# EAGLE design VOLTHAT (EAGLE 9.6.0)
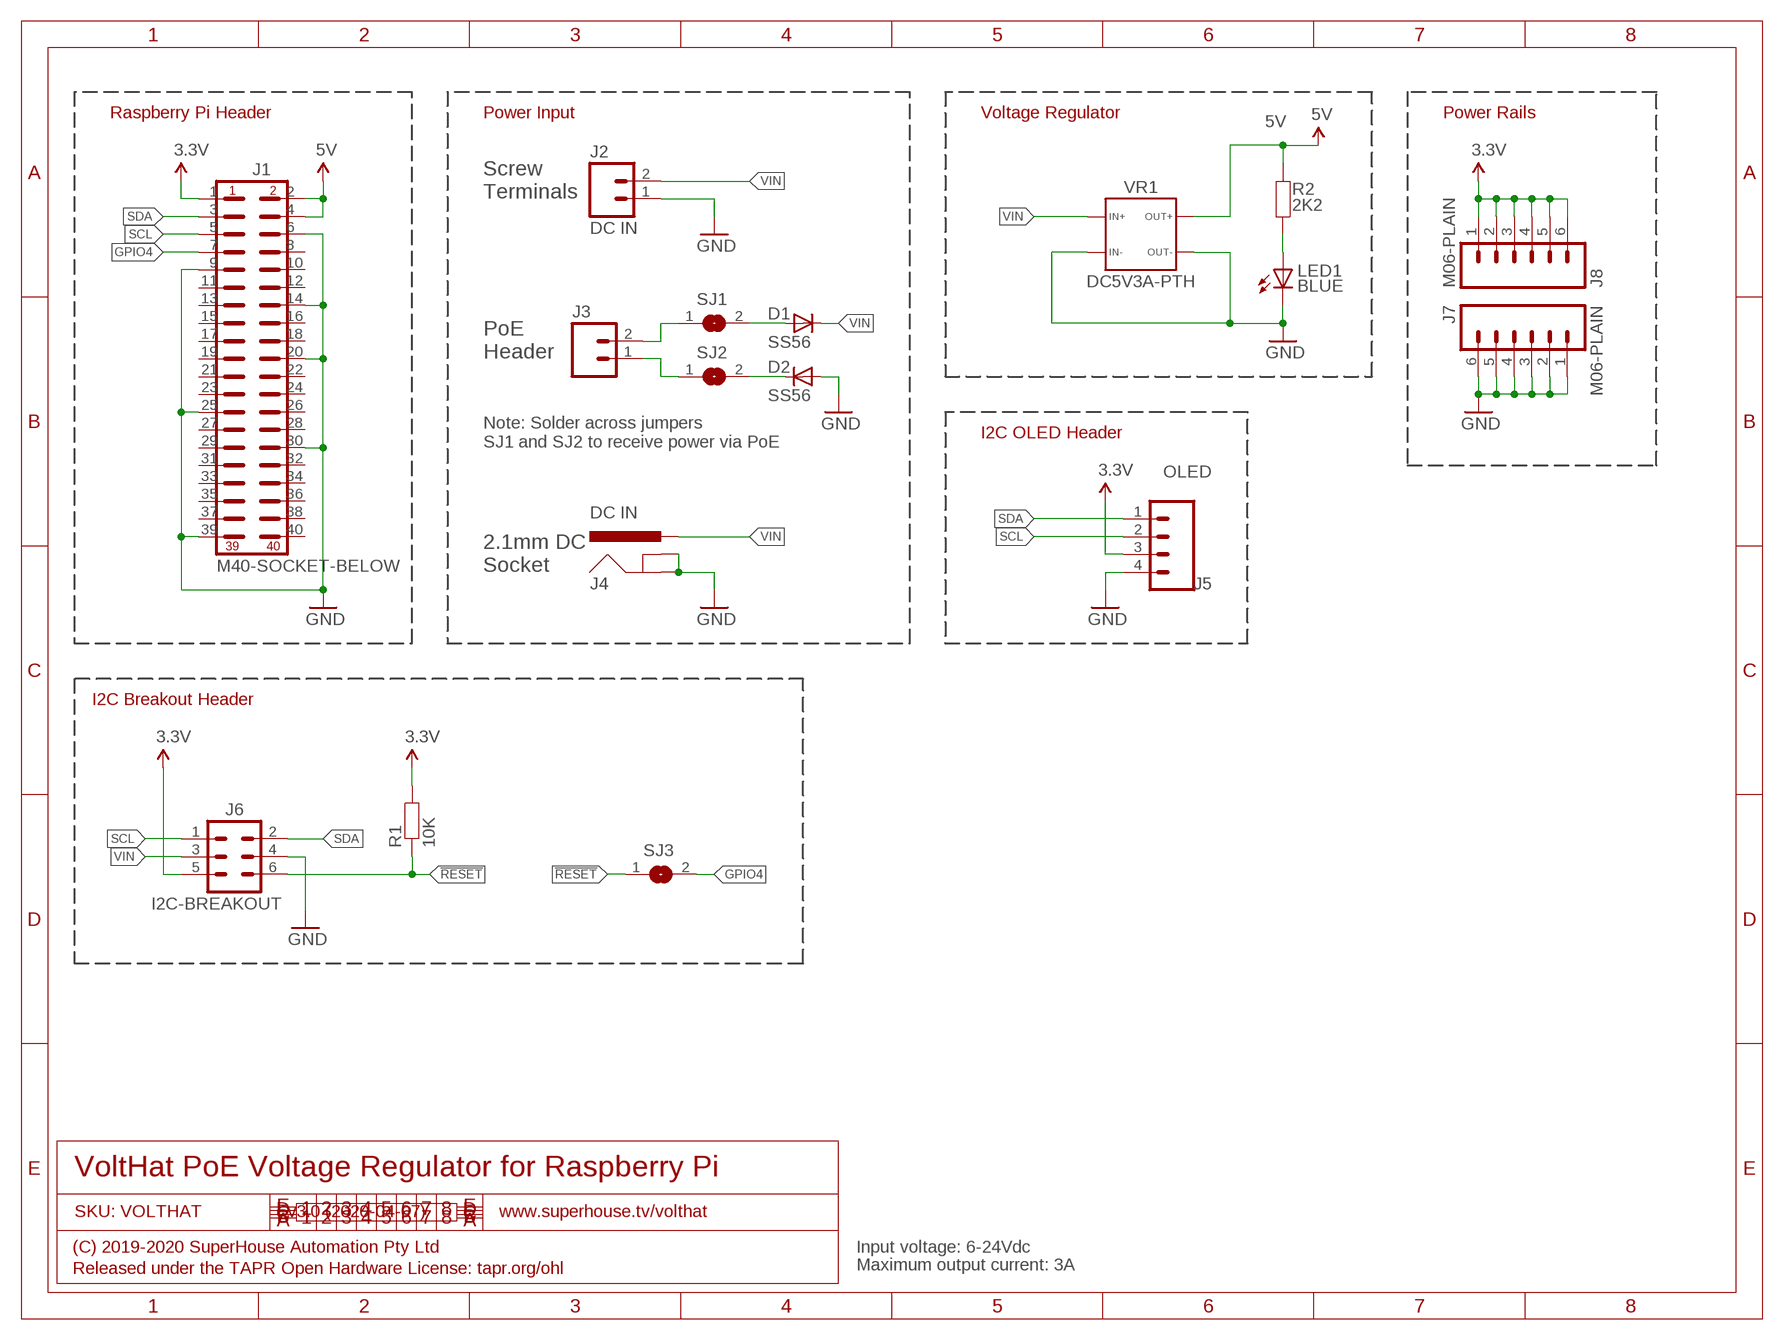
[diagram p0: schematic, sheet 1]

## Parts
D1  SS56  DIODESMA  [SMA-DIODE]
D2  SS56  DIODESMA  [SMA-DIODE]
J1  M40-SOCKET-BELOW  [2X20-S-BELOW]
J2  DC IN  M02-SCREW-3.5MM  [SCREWTERMINAL-3.5MM-2]
J3  M02-SOCKET-BELOW  [1X02-S-BELOW]
J4  DC IN  POWER_JACK-SLOTS  [POWER_JACK_SLOTS]
J5  OLED  M04-PLAIN  [1X04]
J6  I2C-BREAKOUT  M02X3-SHROUDED  [2X03-SHROUDED]
J7  M06-PLAIN  [1X06]
J8  M06-PLAIN  [1X06]
LED1  BLUE  LED0603  [LED-0603]
R1  10K  RESISTOR0603  [R0603]
R2  2K2  RESISTOR0603  [R0603]
SJ1  SJ-NORMAL  [SJ]
SJ2  SJ-NORMAL  [SJ]
SJ3  SJ-NORMAL  [SJ]
VR1  DC5V3A-PTH  [DC5V3A-PTH]

## Nets
3.3V: J1.1 J5.3 J6.5 J8.1 J8.2 J8.3 J8.4 J8.5 J8.6 R1.2
5V: J1.2 J1.4 R2.1 VR1.3A VR1.3B
!RESET: J6.6 R1.1 SJ3.1
GND: D2.A J1.6 J1.9 J1.14 J1.20 J1.25 J1.30 J1.39 J2.1 J4.GND J4.GNDBREAK J5.4 J6.4 J7.1 J7.2 J7.3 J7.4 J7.5 J7.6 LED1.C VR1.1A VR1.1B VR1.4A VR1.4B
GPIO4: J1.7 SJ3.2
N$1: J3.1 SJ2.1
N$2: J3.2 SJ1.1
N$24: D1.A SJ1.2
N$25: D2.C SJ2.2
N$203: LED1.A R2.2
SCL: J1.5 J5.2 J6.1
SDA: J1.3 J5.1 J6.2
VIN: D1.C J2.2 J4.PWR J6.3 VR1.2A VR1.2B
Unconnected: J1.8 J1.10 J1.11 J1.12 J1.13 J1.15 J1.16 J1.17 J1.18 J1.19 J1.21 J1.22 J1.23 J1.24 J1.26 J1.27 J1.28 J1.29 J1.31 J1.32 J1.33 J1.34 J1.35 J1.36 J1.37 J1.38 J1.40

## Notes on the sheet
- Raspberry Pi Header | Power Input | Voltage Regulator | Power Rails
- Screw
  Terminals
- PoE
  Header
- I2C OLED Header
- Note: Solder across jumpers
  SJ1 and SJ2 to receive power via PoE
- 2.1mm DC
  Socket
- I2C Breakout Header
- VoltHat PoE Voltage Regulator for Raspberry Pi
- SKU: VOLTHAT | v3.0 (2020-04-07) | www.superhouse.tv/volthat
- (C) 2019-2020 SuperHouse Automation Pty Ltd | Input voltage: 6-24Vdc
- Released under the TAPR Open Hardware License: tapr.org/ohl | Maximum output current: 3A

## Library data of the parts
D1 D2 = SuperHouse-DiscreteSemi:DIODE: Diode Standard reverse protection diodes and small signal diodes. SMA package can handle up to about 1A. SOD-323 can handle about 200mA.
J1 = SuperHouse-Connectors:M40: 40-way header
J2 J3 = SuperHouse-Connectors:M02: 2-way header Standard 1x2 header, and screw terminal variations
J4 = SuperHouse-Connectors:POWER_JACK: Power Jack This is the standard 5.5mm barrel jack for power. The PTH is the most common, proven, reliable, footprint. All others are experimental. The Slot footprint only works if the mill layer is transmitted to the PCB fab house so be warned. Spark Fun Electronics SKU : PRT-00119. Mating wall wart : TOL-00298 (and others)
J5 = SuperHouse-Connectors:M04: Header 1x4 Standard 0.1" header.
J6 = SuperHouse-Connectors:M02X3: 0.1" header, 2x3 (6-way)
J7 J8 = SuperHouse-Connectors:M06: 1x6 header
LED1 = SuperHouse-LEDs:LED: LEDs Standard schematic elements and footprints for 5mm, 3mm, 1206, and 0603 sized LEDs. 5mm - Spark Fun Electronics SKU : COM-00529 (and others)
R1 R2 = SuperHouse-DiscreteSemi:RESISTOR: Resistor Standard resistors.
SJ1-SJ3 = SuperHouse-Jumpers:SJ: SMD solder jumper, normally-open. Add solder to close the connection.
VR1 = SuperHouse-Regulators:DC5V3A: 5V 3A voltage regulator module from AliExpress

## Board
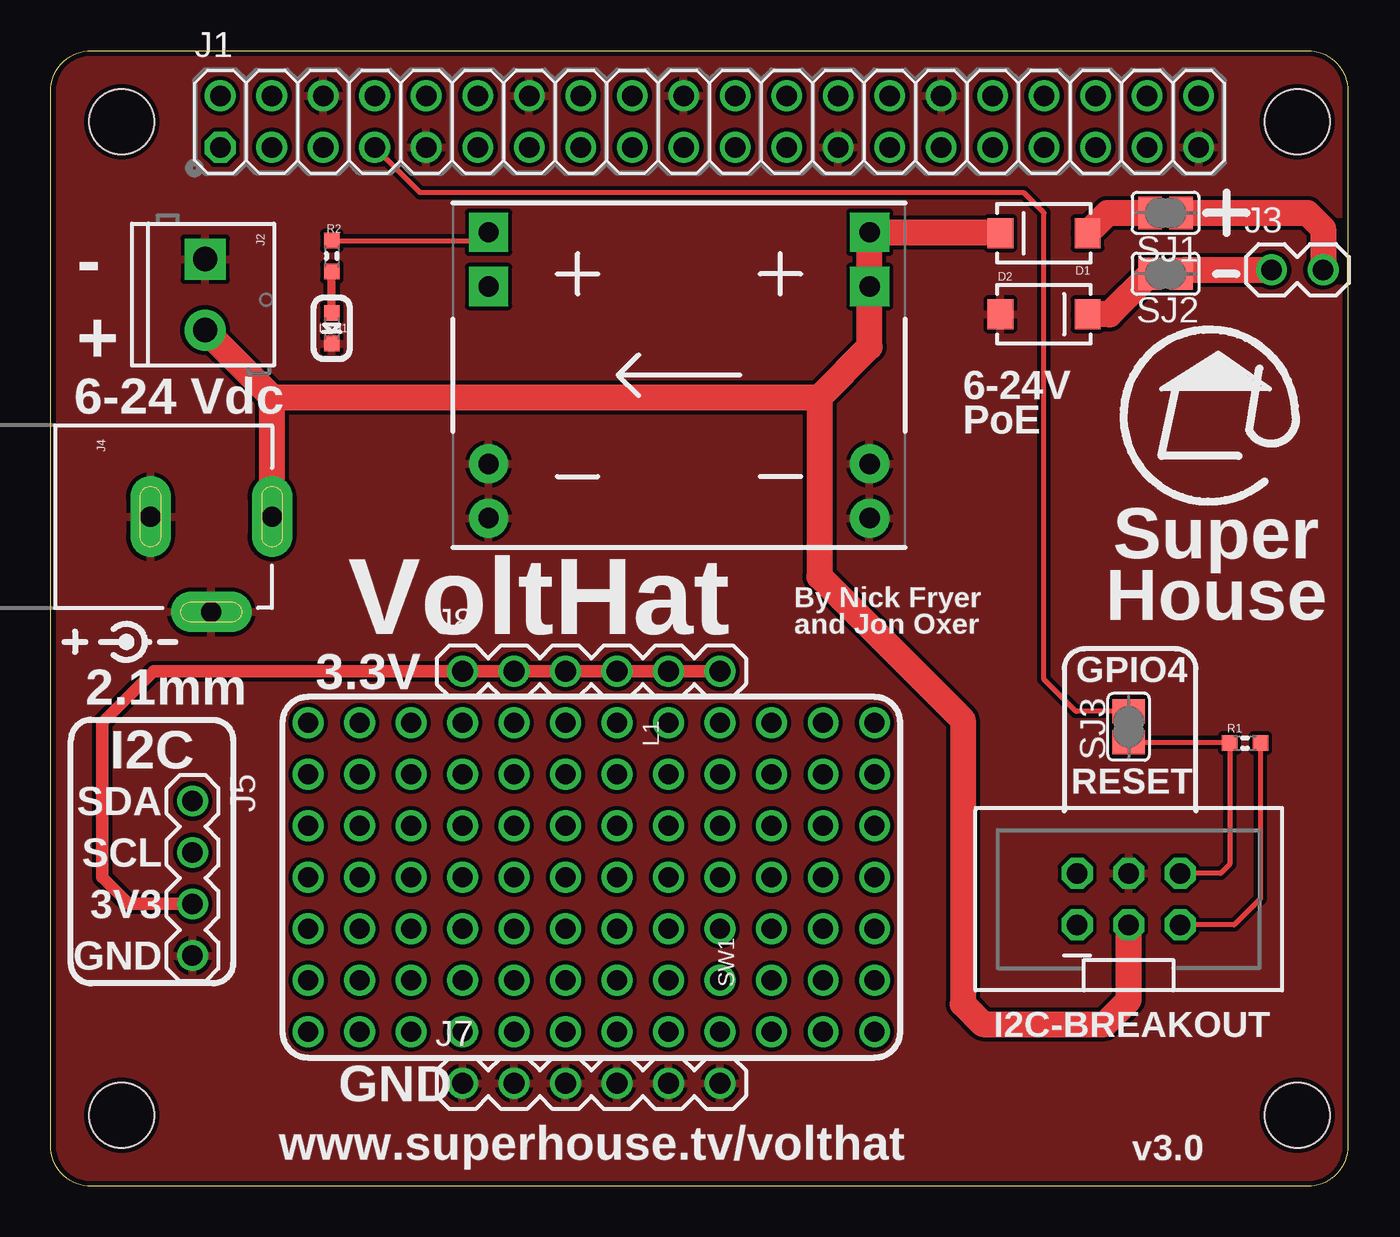
[diagram p1: board, top side]
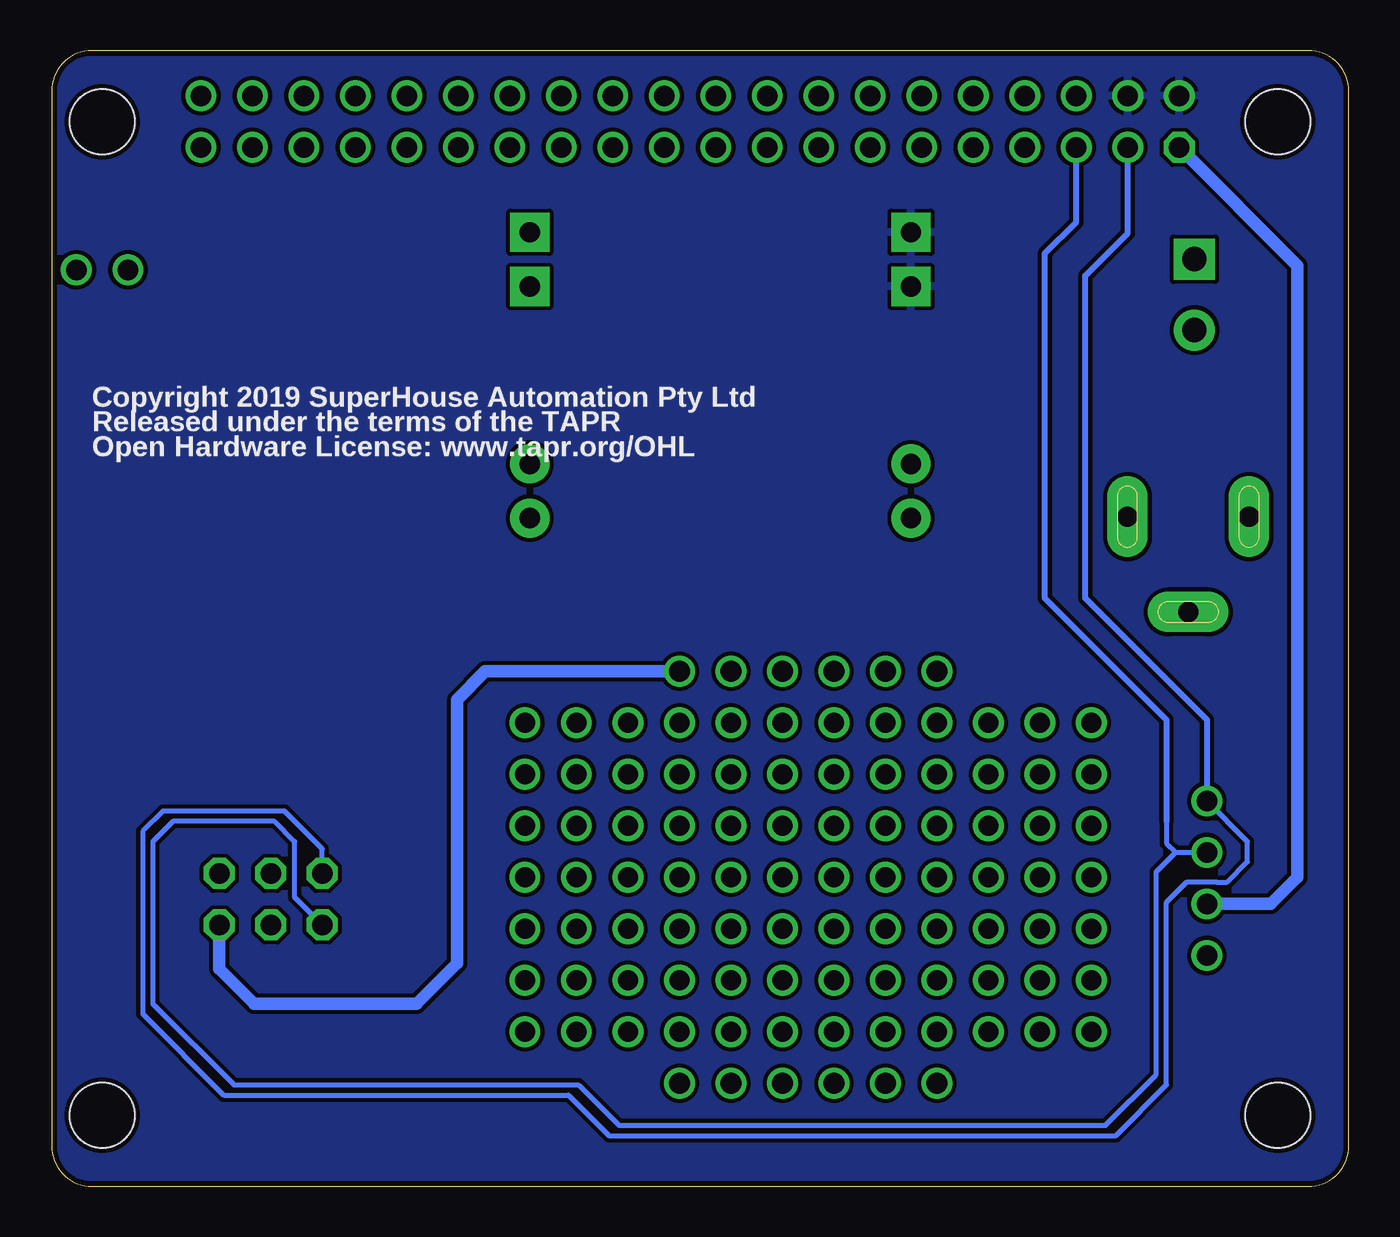
[diagram p2: board, bottom side, seen from below]

Size 64 x 56 mm. Coordinates in mm from the lower left corner, seen from the top.
Outline: 0,54 arc-90 2,56 62,56 arc-90 64,54 64,2 arc-90 62,0 2,0 arc-90 0,2 0,54
Copper layers (1*16): Top 0.035mm / dielectric 1.5mm / Bottom 0.035mm
Design rules "default *": minimum track width 8mil, minimum drill 0.4mm, track to track 8mil, track to pad 8mil, pad to pad 8mil, via to via 8mil, smd to smd 8mil, copper to edge 10mil, drill to drill 8mil, minimum pad ring 8mil, minimum via ring 10mil, stop-mask expansion 3mil, vias tented up to drill 25mil, thermal gap 8mil
Holes 3.2 mm at 3.5,52.5 61.5,52.5 61.5,3.5 3.5,3.5

### Footprints (pad centres in the part's own frame; a part is rotated, then mirrored left to right if it is on the bottom)
SMA-DIODE = smd 1.27 x 1.47: A -2.15,0; C 2.15,0
2X20-S-BELOW = drill 1.016 octagon: 1 0,0 | drill 1.016: 2 0,2.54; 3 2.54,0; 4 2.54,2.54; 5 5.08,0; 6 5.08,2.54; 7 7.62,0; 8 7.62,2.54; 9 10.16,0; 10 10.16,2.54; 11 12.7,0; 12 12.7,2.54; 13 15.24,0; 14 15.24,2.54; 15 17.78,0; 16 17.78,2.54; 17 20.32,0; 18 20.32,2.54; 19 22.86,0; 20 22.86,2.54; 21 25.4,0; 22 25.4,2.54; 23 27.94,0; 24 27.94,2.54; 25 30.48,0; 26 30.48,2.54; 27 33.02,0; 28 33.02,2.54; 29 35.56,0; 30 35.56,2.54; 31 38.1,0; 32 38.1,2.54; 33 40.64,0; 34 40.64,2.54; 35 43.18,0; 36 43.18,2.54; 37 45.72,0; 38 45.72,2.54; 39 48.26,0; 40 48.26,2.54
SCREWTERMINAL-3.5MM-2 = drill 1.2 pad 2.032 square: 1 0,0 | drill 1.2 pad 2.032: 2 3.5,0
1X02-S-BELOW = drill 1.016: 1 0,0; 2 2.54,0
POWER_JACK_SLOTS = drill 1 pad 2 long: GND 0,7.7; GNDBREAK 4.7,10.7; PWR 0,13.7
1X04 = drill 1.016: 1 0,0; 2 2.54,0; 3 5.08,0; 4 7.62,0
2X03-SHROUDED = drill 1.016 octagon: 1 -1.27,2.54; 2 1.27,2.54; 3 -1.27,0; 4 1.27,0; 5 -1.27,-2.54; 6 1.27,-2.54
1X06 = drill 1.016: 1 0,0; 2 2.54,0; 3 5.08,0; 4 7.62,0; 5 10.16,0; 6 12.7,0
LED-0603 = smd 0.762 x 0.762: A -0.762,0; C 0.762,0
R0603 = smd 0.762 x 0.762: 1 -0.762,0; 2 0.762,0
SJ = smd 1.168 x 1.6: 1 -0.762,0; 2 0.762,0
DC5V3A-PTH = drill 1 pad 1.93: 1A -9.4,7.05; 1B -9.4,4.375; 4A 9.4,7.05; 4B 9.4,4.375 | drill 1 pad 1.93 square: 2A -9.4,-4.375; 2B -9.4,-7.05; 3A 9.4,-4.375; 3B 9.4,-7.05

### Placement (x,y rotation side)
D1  49,47 180 top
D2  49,43 0 top
J1  8.37,51.23 0 top
J2  7.62,45.72 270 top
J3  60.23,45.19 0 top
J4  -2.78,33.02 270 top
J5  7,19 270 top
J6  53.18,14.16 90 top
J7  20.32,5.08 0 top
J8  20.32,25.4 0 top
LED1  13.86,42.31 270 top
R1  58.92,21.86 0 top
R2  13.86,45.87 270 top
SJ1  55,48 180 top
SJ2  55,45 180 top
SJ3  53.18,22.66 90 top
VR1  31,40 180 top

### Tracks (layer width: path | path; a pad name or v marks a point on that pad's centre or on a via)
3.3V
  Top 0.254: R1.2 59.68,14.18 58.39,12.89 J6.5
  Top 0.61: J5.3 3.86,13.92 2.54,15.24 2.54,22.86 5.08,25.4 J8.1 J8.2 J8.3 J8.4 J8.5 J8.6
  Bottom 0.61: J5.3 3.86,13.92 2.54,15.24 2.54,45.4 J1.1 | J8.6 42.6,25.4 44,24 44,11 46,9 54,9 55.72,10.72 J6.5
5V
  Top 0.254: R2.1 21.28,46.63 21.25,46.7 VR1.3B
  pour Bottom: 2,56.32 61.94,56.32 arc-90 63.94,54.32 63.94,2 arc-90 61.94,0 2,0 arc-90 0,2 0,54.32 arc-90
!RESET
  Top 0.254: SJ3.1 58.12,21.9 R1.1 58.16,15.87 57.72,15.43 J6.6
GND
  pour Top: 2,56 64,56 64,0 2,0 arc-90 0,2 0,54 arc-90
GPIO4
  Top 0.254: SJ3.2 50.58,23.42 49,25 49,48 48,49 18.22,49 J1.7
N$1
  Top 0.813: SJ2.1 55.95,45.19
  Top 1.27: 55.95,45.19 J3.1
N$2
  Top 1.27: J3.2 62.77,47.23 62,48 SJ1.1
N$3  (via drill 1)
  other vias: 12.7,22.86
N$4  (via drill 1)
  other vias: 15.24,22.86
N$5  (via drill 1)
  other vias: 17.78,22.86
N$6  (via drill 1)
  other vias: 12.7,20.32
N$7  (via drill 1)
  other vias: 15.24,20.32
N$8  (via drill 1)
  other vias: 17.78,20.32
N$9  (via drill 1)
  other vias: 12.7,17.78
N$10  (via drill 1)
  other vias: 15.24,17.78
N$11  (via drill 1)
  other vias: 17.78,17.78
N$12  (via drill 1)
  other vias: 12.7,15.24
N$13  (via drill 1)
  other vias: 15.24,15.24
N$14  (via drill 1)
  other vias: 17.78,15.24
N$15  (via drill 1)
  other vias: 12.7,12.7
N$16  (via drill 1)
  other vias: 15.24,12.7
N$17  (via drill 1)
  other vias: 17.78,12.7
N$18  (via drill 1)
  other vias: 12.7,10.16
N$19  (via drill 1)
  other vias: 15.24,10.16
N$20  (via drill 1)
  other vias: 17.78,10.16
N$21  (via drill 1)
  other vias: 12.7,7.62
N$22  (via drill 1)
  other vias: 15.24,7.62
N$23  (via drill 1)
  other vias: 17.78,7.62
N$24
  Top 1.27: D1.A 52.15,48 SJ1.2
N$25
  Top 1.27: SJ2.2 52.24,43 D2.C
N$31  (via drill 1)
  other vias: 20.32,22.86
N$32  (via drill 1)
  other vias: 22.86,22.86
N$33  (via drill 1)
  other vias: 25.4,22.86
N$34  (via drill 1)
  other vias: 27.94,22.86
N$35  (via drill 1)
  other vias: 30.48,22.86
N$36  (via drill 1)
  other vias: 33.02,22.86
N$37  (via drill 1)
  other vias: 35.56,22.86
N$38  (via drill 1)
  other vias: 38.1,22.86
N$39  (via drill 1)
  other vias: 40.64,22.86
N$55  (via drill 1)
  other vias: 20.32,20.32
N$56  (via drill 1)
  other vias: 22.86,20.32
N$57  (via drill 1)
  other vias: 25.4,20.32
N$58  (via drill 1)
  other vias: 27.94,20.32
N$59  (via drill 1)
  other vias: 30.48,20.32
N$60  (via drill 1)
  other vias: 33.02,20.32
N$61  (via drill 1)
  other vias: 35.56,20.32
N$62  (via drill 1)
  other vias: 38.1,20.32
N$63  (via drill 1)
  other vias: 40.64,20.32
N$79  (via drill 1)
  other vias: 20.32,17.78
N$80  (via drill 1)
  other vias: 22.86,17.78
N$81  (via drill 1)
  other vias: 25.4,17.78
N$82  (via drill 1)
  other vias: 27.94,17.78
N$83  (via drill 1)
  other vias: 30.48,17.78
N$84  (via drill 1)
  other vias: 33.02,17.78
N$85  (via drill 1)
  other vias: 35.56,17.78
N$86  (via drill 1)
  other vias: 38.1,17.78
N$87  (via drill 1)
  other vias: 40.64,17.78
N$103  (via drill 1)
  other vias: 20.32,15.24
N$104  (via drill 1)
  other vias: 22.86,15.24
N$105  (via drill 1)
  other vias: 25.4,15.24
N$106  (via drill 1)
  other vias: 27.94,15.24
N$107  (via drill 1)
  other vias: 30.48,15.24
N$108  (via drill 1)
  other vias: 33.02,15.24
N$109  (via drill 1)
  other vias: 35.56,15.24
N$110  (via drill 1)
  other vias: 38.1,15.24
N$111  (via drill 1)
  other vias: 40.64,15.24
N$127  (via drill 1)
  other vias: 20.32,12.7
N$128  (via drill 1)
  other vias: 22.86,12.7
N$129  (via drill 1)
  other vias: 25.4,12.7
N$130  (via drill 1)
  other vias: 27.94,12.7
N$131  (via drill 1)
  other vias: 30.48,12.7
N$132  (via drill 1)
  other vias: 33.02,12.7
N$133  (via drill 1)
  other vias: 35.56,12.7
N$134  (via drill 1)
  other vias: 38.1,12.7
N$135  (via drill 1)
  other vias: 40.64,12.7
N$151  (via drill 1)
  other vias: 20.32,10.16
N$152  (via drill 1)
  other vias: 22.86,10.16
N$153  (via drill 1)
  other vias: 25.4,10.16
N$154  (via drill 1)
  other vias: 27.94,10.16
N$155  (via drill 1)
  other vias: 30.48,10.16
N$156  (via drill 1)
  other vias: 33.02,10.16
N$157  (via drill 1)
  other vias: 35.56,10.16
N$158  (via drill 1)
  other vias: 38.1,10.16
N$159  (via drill 1)
  other vias: 40.64,10.16
N$175  (via drill 1)
  other vias: 20.32,7.62
N$176  (via drill 1)
  other vias: 22.86,7.62
N$177  (via drill 1)
  other vias: 25.4,7.62
N$178  (via drill 1)
  other vias: 27.94,7.62
N$179  (via drill 1)
  other vias: 30.48,7.62
N$180  (via drill 1)
  other vias: 33.02,7.62
N$181  (via drill 1)
  other vias: 35.56,7.62
N$182  (via drill 1)
  other vias: 38.1,7.62
N$183  (via drill 1)
  other vias: 40.64,7.62
N$203
  Top 0.406: LED1.A R2.2
SCL
  Bottom 0.254: J6.1 52,14.25 52,17 53,18 58,18 59,17 59,9 55,5 38,5 36,3 12,3 9.5,5.5 9.5,15.5 8.54,16.46 | 8.54,16.46 J5.2 | 9,18 9,16.92 8.54,16.46
  Bottom 0.305: 9,18 9,23 15,29 15,46 13.45,47.55 J1.5
SDA
  Bottom 0.254: J6.2 50.64,16.64 52.5,18.5 58.5,18.5 59.5,17.5 59.5,8.5 55.5,4.5 38.5,4.5 36.5,2.5 11.5,2.5 9,5 9,14 7.99,15.01 6.55,15.01 6.54,15 6,15 5,16 5,17 J5.1
  Bottom 0.305: J1.3 10.91,47 13,44.91 13,29 7,23 J5.1
VIN
  Top 1.27: J4.PWR 10.92,38.92 | J2.2 10.92,38.92 | 10.92,38.92 37.92,38.92 | D1.C 46.8,47.05 VR1.2B VR1.2A 40.4,41.4 37.92,38.92 | 37.92,38.92 37.92,30.08 45,23 45,9 46,8 52,8 53.18,9.18 J6.3

### Text on the board
tPlace: - | + | 6-24 Vdc | 6-24V / PoE | Super / House | By Nick Fryer / and Jon Oxer | VoltHat | 3.3V | GPIO4 | 2.1mm | I2C | SDA | RESET | SCL | 3V3 | GND | I2C-BREAKOUT | GND | www.superhouse.tv/volthat | v3.0
bPlace: Copyright 2019 SuperHouse Automation Pty Ltd / Released under the terms of the TAPR / Open Hardware License: www.tapr.org/OHL
tNames: L1 | SW1